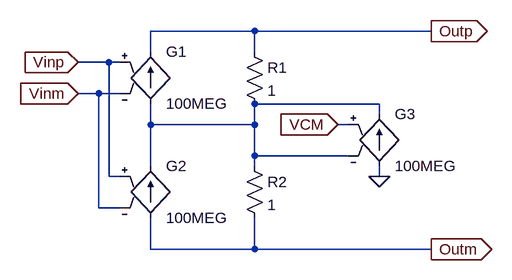
[diagram p0: schematic Ideal_differential_op_amp.asc]
Ideal_differential_op_amp.asc, the LTspice schematic file:
Version 4
SHEET 1 6300 692
WIRE 1632 240 1472 240
WIRE 1904 240 1632 240
WIRE 1472 272 1472 240
WIRE 1632 272 1632 240
WIRE 1408 288 1360 288
WIRE 1424 288 1408 288
WIRE 1392 336 1360 336
WIRE 1424 336 1392 336
WIRE 1824 352 1632 352
WIRE 1824 368 1824 352
WIRE 1472 384 1472 352
WIRE 1632 384 1632 352
WIRE 1632 384 1472 384
WIRE 1776 384 1760 384
WIRE 1632 432 1632 384
WIRE 1776 432 1632 432
WIRE 1472 448 1472 384
WIRE 1632 448 1632 432
WIRE 1408 464 1408 288
WIRE 1424 464 1408 464
WIRE 1824 464 1824 448
WIRE 1392 512 1392 336
WIRE 1424 512 1392 512
WIRE 1472 576 1472 528
WIRE 1632 576 1632 528
WIRE 1632 576 1472 576
WIRE 1904 576 1632 576
FLAG 1904 240 Outp
IOPIN 1904 240 Out
FLAG 1360 288 Vinp
IOPIN 1360 288 In
FLAG 1360 336 Vinm
IOPIN 1360 336 In
FLAG 1904 576 Outm
IOPIN 1904 576 Out
FLAG 1760 384 VCM
IOPIN 1760 384 In
FLAG 1824 464 0
SYMBOL res 1616 256 R0
SYMATTR InstName R1
SYMATTR Value 1
SYMBOL res 1616 432 R0
SYMATTR InstName R2
SYMATTR Value 1
SYMBOL g 1472 256 R0
SYMATTR InstName G1
SYMATTR Value 100MEG
SYMBOL g 1472 432 R0
SYMATTR InstName G2
SYMATTR Value 100MEG
SYMBOL g 1824 352 R0
SYMATTR InstName G3
SYMATTR Value 100MEG

The netlist it stands for:
* Ideal_differential_op_amp.asc
R1 Outp N001 1
R2 N001 Outm 1
G1 N001 Outp Vinp Vinm 100MEG
G2 Outm N001 Vinp Vinm 100MEG
G3 0 N001 VCM N001 100MEG
.backanno
.end